# EAGLE schematic ArduinixMOD (EAGLE 7.2.0)
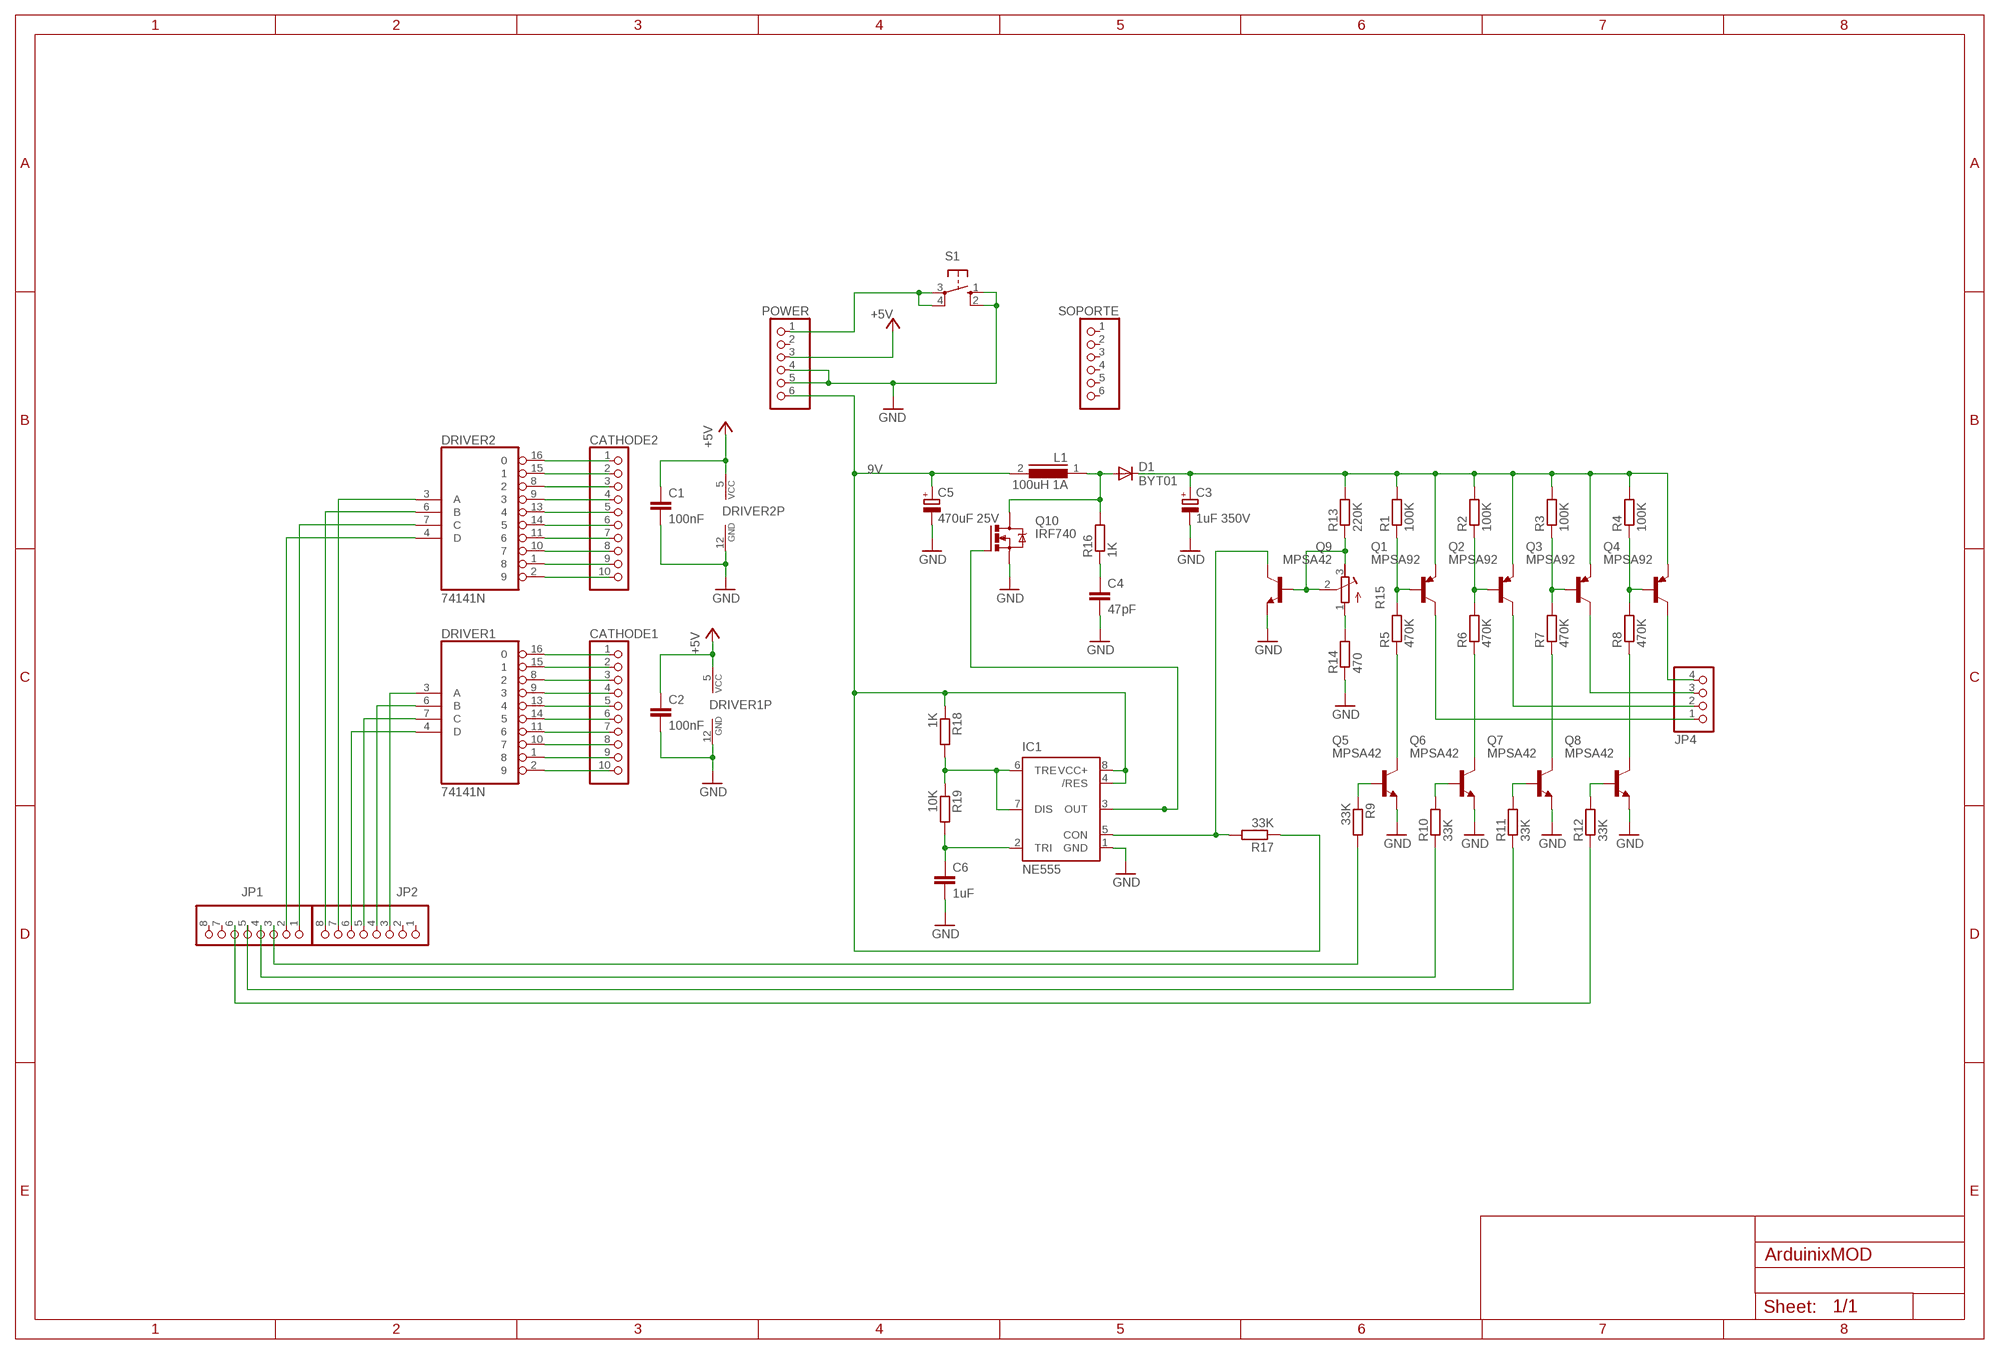
[diagram p0: schematic, sheet 1]

## Parts
C1  100nF  C-EU025-025X050  [C025-025X050]
C2  100nF  C-EU025-025X050  [C025-025X050]
C3  1uF 350V  CPOL-EUE2.5-7  [E2,5-7]
C4  47pF  C-EU025-025X050  [C025-025X050]
C5  470uF 25V  CPOL-EUE5-10.5  [E5-10,5]
C6  1uF  C-EU025-025X050  [C025-025X050]
CATHODE1  PINHD-1X10  [1X10]
CATHODE2  PINHD-1X10  [1X10]
D1  BYT01  [F126-10]
DRIVER1  74141N  [DIL16]
DRIVER2  74141N  [DIL16]
IC1  NE555  [DIL-08]
JP1  PINHD-1X8  [1X08]
JP2  PINHD-1X8  [1X08]
JP4  PINHD-1X4  [1X04]
L1  100uH 1A  MESC26  [MESC26]
POWER  PINHD-1X6  [1X06]
Q1  MPSA92  2N4126  [TO92-CBE]
Q2  MPSA92  2N4126  [TO92-CBE]
Q3  MPSA92  2N4126  [TO92-CBE]
Q4  MPSA92  2N4126  [TO92-CBE]
Q5  MPSA42  BC447  [TO92-EBC]
Q6  MPSA42  BC447  [TO92-EBC]
Q7  MPSA42  BC447  [TO92-EBC]
Q8  MPSA42  BC447  [TO92-EBC]
Q9  MPSA42  BC447  [TO92-EBC]
Q10  IRF740  [TO220BV]
R1  100K  R-EU_R1206  [R1206]
R2  100K  R-EU_R1206  [R1206]
R3  100K  R-EU_R1206  [R1206]
R4  100K  R-EU_R1206  [R1206]
R5  470K  R-EU_R1206  [R1206]
R6  470K  R-EU_R1206  [R1206]
R7  470K  R-EU_R1206  [R1206]
R8  470K  R-EU_R1206  [R1206]
R9  33K  R-EU_R1206  [R1206]
R10  33K  R-EU_R1206  [R1206]
R11  33K  R-EU_R1206  [R1206]
R12  33K  R-EU_R1206  [R1206]
R13  220K  R-EU_R1206  [R1206]
R14  470  R-EU_R1206  [R1206]
R15  R-TRIMM64W  [RTRIM64W]
R16  1K  R-EU_R1206  [R1206]
R17  33K  R-EU_R1206  [R1206]
R18  1K  R-EU_R1206  [R1206]
R19  10K  R-EU_R1206  [R1206]
S1  10-XX  [B3F-10XX]
SOPORTE  PINHD-1X6  [1X06]

## Nets
9V: C5.+ IC1.4(/RES) IC1.8(VCC+) L1.2 POWER.6 R17.1 R18.1
+5V: C1.1 C2.1 DRIVER1.5(VCC) DRIVER2.5(VCC) POWER.3
GND: C1.2 C2.2 C3.- C4.2 C5.- C6.2 DRIVER1.12(GND) DRIVER2.12(GND) IC1.1(GND) POWER.4 POWER.5 Q5.E Q6.E Q7.E Q8.E Q9.E Q10.S R14.1 S1.1(S) S1.2(S1)
N$1: CATHODE2.9 DRIVER2.1
N$2: CATHODE2.10 DRIVER2.2
N$3: DRIVER2.3(A) JP2.7
N$4: DRIVER2.4(D) JP1.2
N$5: DRIVER2.6(B) JP2.8
N$6: DRIVER2.7(C) JP1.1
N$7: CATHODE2.3 DRIVER2.8
N$8: CATHODE2.4 DRIVER2.9
N$9: CATHODE2.8 DRIVER2.10
N$10: CATHODE2.7 DRIVER2.11
N$11: DRIVER1.4(D) JP2.6
N$12: CATHODE2.5 DRIVER2.13
N$13: CATHODE2.6 DRIVER2.14
N$14: CATHODE2.2 DRIVER2.15
N$15: CATHODE2.1 DRIVER2.16
N$16: DRIVER1.6(B) JP2.4
N$17: DRIVER1.7(C) JP2.5
N$18: CATHODE1.3 DRIVER1.8
N$19: CATHODE1.9 DRIVER1.1
N$20: CATHODE1.10 DRIVER1.2
N$21: DRIVER1.3(A) JP2.3
N$22: CATHODE1.4 DRIVER1.9
N$23: CATHODE1.8 DRIVER1.10
N$24: CATHODE1.7 DRIVER1.11
N$25: CATHODE1.5 DRIVER1.13
N$26: CATHODE1.6 DRIVER1.14
N$27: CATHODE1.2 DRIVER1.15
N$28: CATHODE1.1 DRIVER1.16
N$29: Q1.B R1.1 R5.2
N$30: Q2.B R2.1 R6.2
N$31: Q3.B R3.1 R7.2
N$32: Q4.B R4.1 R8.2
N$33: D1.A L1.1 Q10.D R16.2
N$34: JP4.2 Q2.C
N$35: JP1.3 R9.2
N$36: JP4.1 Q1.C
N$37: JP1.4 R10.1
N$38: JP4.3 Q3.C
N$39: JP4.4 Q4.C
N$40: Q5.C R5.1
N$41: Q6.C R6.1
N$42: Q5.B R9.1
N$43: Q6.B R10.2
N$44: Q7.B R11.2
N$45: Q7.C R7.1
N$46: Q8.C R8.1
N$47: Q8.B R12.2
N$48: JP1.5 R11.1
N$49: JP1.6 R12.1
N$50: Q9.B R13.1 R15.2(S) R15.3(E)
N$51: C4.1 R16.1
N$52: R14.2 R15.1(A)
N$53: C3.+ D1.C Q1.E Q2.E Q3.E Q4.E R1.2 R2.2 R3.2 R4.2 R13.2
N$54: IC1.6(TRE) IC1.7(DIS) R18.2 R19.1
N$55: C6.1 IC1.2(TRI) R19.2
N$56: POWER.1 S1.3(P) S1.4(P1)
N$60: IC1.5(CON) Q9.C R17.2
N$62: IC1.3(OUT) Q10.G
Unconnected: JP1.7 JP1.8 JP2.1 JP2.2 POWER.2 SOPORTE.1 SOPORTE.2 SOPORTE.3 SOPORTE.4 SOPORTE.5 SOPORTE.6

## Library data of the parts
C1 C2 C4 C6 = rcl:C-EU: CAPACITOR, European symbol
C3 C5 = rcl:CPOL-EU: POLARIZED CAPACITOR, European symbol
CATHODE1 CATHODE2 = pinhead:PINHD-1X10: PIN HEADER
D1 = diode:BYT01: DIODE ultra fast
DRIVER1 DRIVER2 = 74xx-eu:74*141: BCD to decimal DECODER/DRIVER
IC1 = st-microelectronics:NE555: General purpose bipolar Timer; MF: Arrow Electronics; MPN: NE555N; OC_FARNELL: 1467742; OC_NEWARK: 89K1486
JP1 JP2 = pinhead:PINHD-1X8: PIN HEADER
JP4 = pinhead:PINHD-1X4: PIN HEADER
L1 = inductors:MESC26: INDUCTOR
POWER SOPORTE = pinhead:PINHD-1X6: PIN HEADER
Q1-Q4 = transistor-pnp:2N4126*: PNP Transistror
Q5-Q9 = transistor-npn:BC447*: NPN Transistor
Q10 = transistor-power:IRF740: N-CHANNEL MOS FET
R1-R14 R16-R19 = rcl:R-EU_: RESISTOR, European symbol
R15 = rcl:R-TRIMM: Trimm resistor
S1 = switch-omron:10-XX: OMRON SWITCH; MPN: B3F-1000; OC_FARNELL: 176432; OC_NEWARK: 36M3542